# Altium schematic sheet IR Prox Sensor.SchDoc
size A
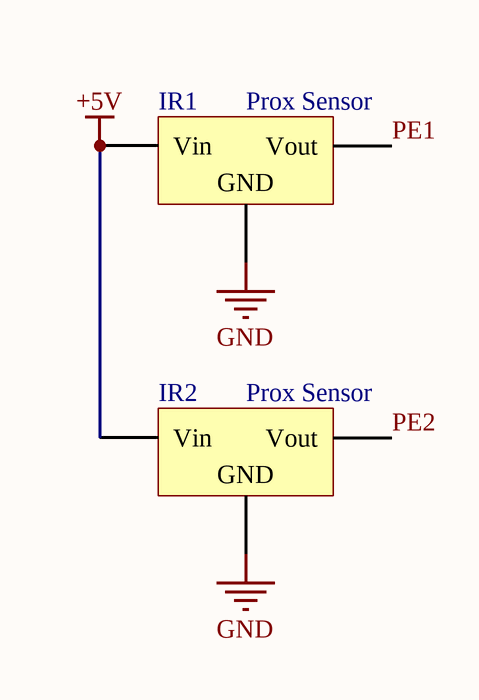
[diagram p0: IR Prox Sensor.SchDoc]

## Parts
IR1  Prox Sensor  [D2PAK_L]
IR2  Prox Sensor  [D2PAK_L]

## Nets
+5V: IR1.1(Vin) IR2.1(Vin)
GND: IR1.2(GND) IR2.2(GND)
PE1: IR1.3(Vout)
PE2: IR2.3(Vout)

## Library data of the parts
IR1 IR2 = Volt Reg: Voltage Regulator; Published: 24-Mar-1999; LatestRevisionDate: 29-May-2009; LatestRevisionNote: IPC-7351 Footprint Added.; PackageReference: D2PAK; Publisher: Altium Limited; PackageDescription: 3-Pin Transistor Outline Package 2.54 mm Pitch, 15.1 mm Lead Span